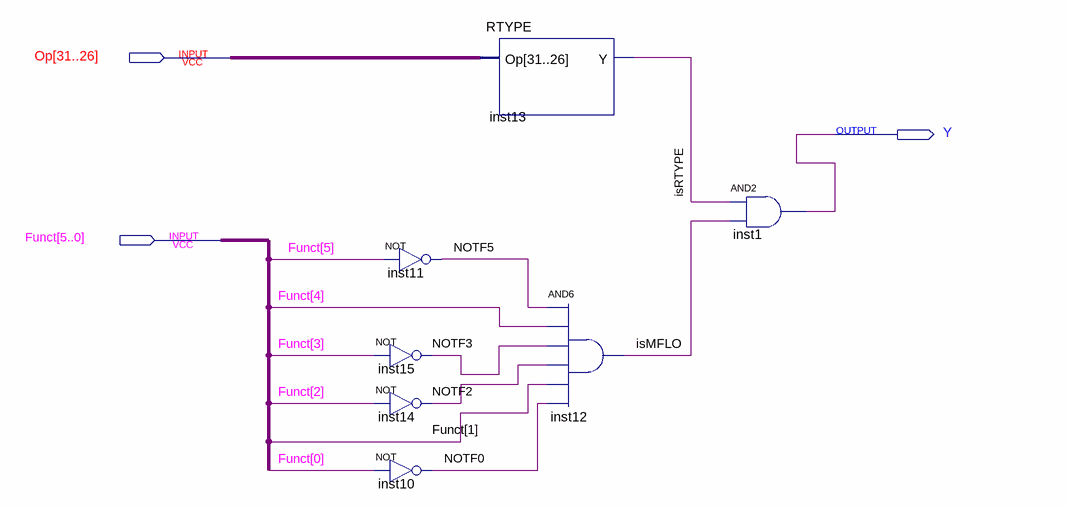
[diagram p0: schematic sheet]
// Quartus schematic MFLO.bdf as structural Verilog: 7 symbols, 3 pins
module MFLO (
  input  [31:26] Op,
  input  [5:0] Funct,
  output Y
);

  wire isMFLO, isRTYPE, NOTF0, NOTF2, NOTF3, NOTF5;

  not inst11 (NOTF5, Funct[5]);
  not inst15 (NOTF3, Funct[3]);
  not inst14 (NOTF2, Funct[2]);
  not inst10 (NOTF0, Funct[0]);
  RTYPE inst13 (.Op(Op), .Y(isRTYPE));
  and inst12 (isMFLO, NOTF5, Funct[4], NOTF3, NOTF2, Funct[1], NOTF0);
  and inst1 (Y, isRTYPE, isMFLO);
endmodule
